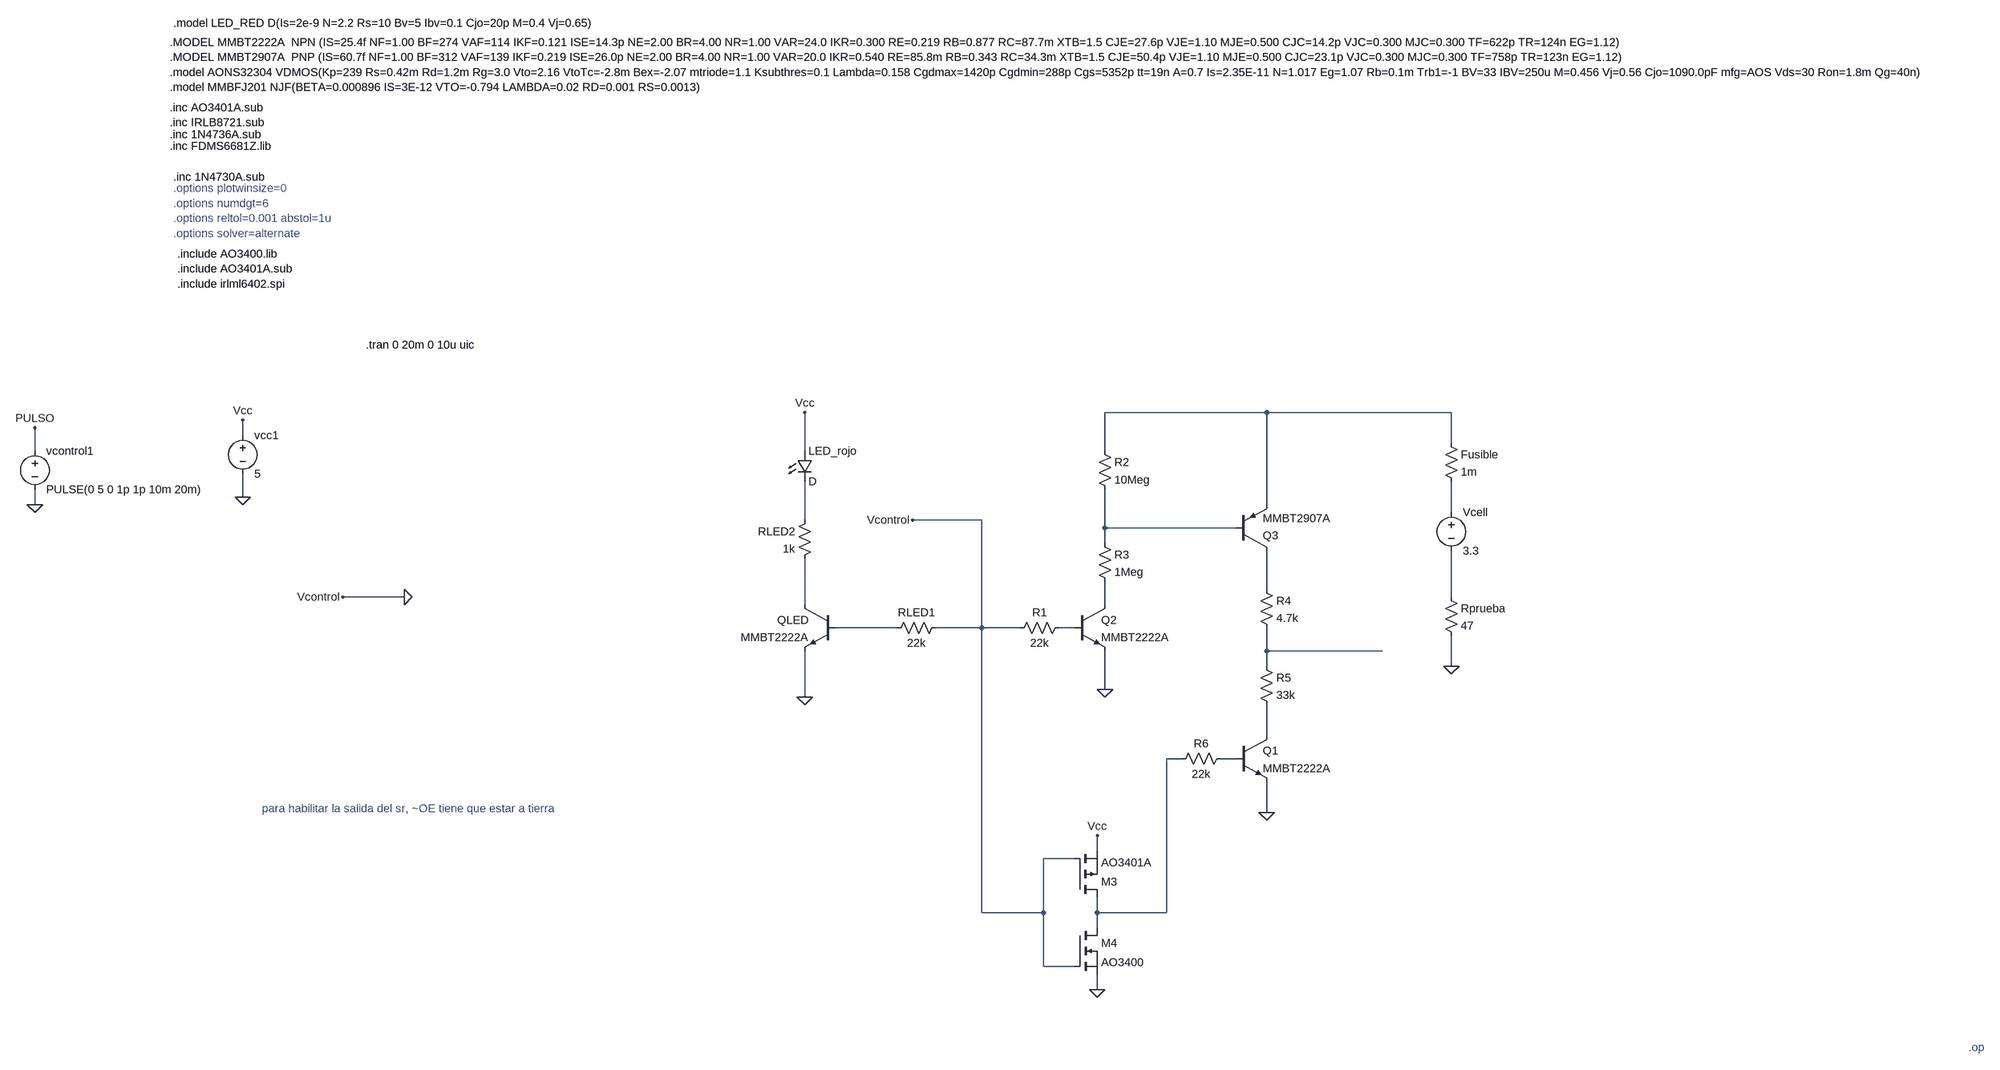
[diagram p0: schematic prueba_celda_2.1.asc]
prueba_celda_2.1.asc, the LTspice schematic file:
Version 4.1
SHEET 1 5252 680
WIRE 2688 -816 2352 -816
WIRE 3072 -816 2688 -816
WIRE 560 -768 560 -800
WIRE 3072 -752 3072 -816
WIRE 128 -736 128 -784
WIRE 1728 -736 1728 -816
WIRE 2352 -736 2352 -816
WIRE 560 -640 560 -688
WIRE 128 -624 128 -656
WIRE 2688 -624 2688 -816
WIRE 3072 -608 3072 -672
WIRE 1728 -592 1728 -672
WIRE 2096 -592 1952 -592
WIRE 2352 -576 2352 -656
WIRE 2624 -576 2352 -576
WIRE 2352 -544 2352 -576
WIRE 2688 -448 2688 -528
WIRE 896 -432 768 -432
WIRE 3072 -432 3072 -528
WIRE 1728 -416 1728 -512
WIRE 2352 -416 2352 -464
WIRE 1920 -368 1792 -368
WIRE 2096 -368 2096 -592
WIRE 2096 -368 2000 -368
WIRE 2176 -368 2096 -368
WIRE 2288 -368 2256 -368
WIRE 2688 -320 2688 -368
WIRE 2928 -320 2688 -320
WIRE 2688 -288 2688 -320
WIRE 3072 -288 3072 -352
WIRE 2352 -240 2352 -320
WIRE 1728 -224 1728 -320
WIRE 2688 -144 2688 -208
WIRE 2512 -96 2480 -96
WIRE 2624 -96 2592 -96
WIRE 2688 16 2688 -48
WIRE 2336 96 2336 64
WIRE 2288 112 2224 112
WIRE 2096 224 2096 -368
WIRE 2224 224 2224 112
WIRE 2224 224 2096 224
WIRE 2336 224 2336 192
WIRE 2480 224 2480 -96
WIRE 2480 224 2336 224
WIRE 2336 256 2336 224
WIRE 2224 336 2224 224
WIRE 2288 336 2224 336
WIRE 2336 384 2336 352
FLAG 128 -624 0
FLAG 560 -640 0
FLAG 560 -800 Vcc
FLAG 128 -784 PULSO
FLAG 2352 -240 0
FLAG 2688 16 0
FLAG 1728 -816 Vcc
FLAG 2336 384 0
FLAG 2336 64 Vcc
FLAG 1728 -224 0
FLAG 3072 -288 0
FLAG 1952 -592 Vcontrol
FLAG 768 -432 Vcontrol
FLAG 896 -432 0
SYMBOL voltage 128 -752 R0
WINDOW 123 0 0 Left 0
WINDOW 39 0 0 Left 0
SYMATTR InstName vcontrol1
SYMATTR Value PULSE(0 5 0 1p 1p 10m 20m)
SYMBOL voltage 560 -784 R0
WINDOW 123 0 0 Left 0
WINDOW 39 0 0 Left 0
SYMATTR InstName vcc1
SYMATTR Value 5
SYMBOL npn 2624 -144 R0
SYMATTR InstName Q1
SYMATTR Value MMBT2222A
SYMBOL res 2672 -304 R0
SYMATTR InstName R5
SYMATTR Value 33k
SYMBOL res 2672 -464 R0
SYMATTR InstName R4
SYMATTR Value 4.7k
SYMBOL npn 2288 -416 R0
SYMATTR InstName Q2
SYMATTR Value MMBT2222A
SYMBOL res 2336 -560 R0
SYMATTR InstName R3
SYMATTR Value 1Meg
SYMBOL res 2336 -752 R0
SYMATTR InstName R2
SYMATTR Value 10Meg
SYMBOL res 2608 -112 R90
WINDOW 0 0 56 VBottom 2
WINDOW 3 32 56 VTop 2
SYMATTR InstName R6
SYMATTR Value 22k
SYMBOL voltage 3072 -624 R0
WINDOW 123 0 0 Left 0
WINDOW 39 0 0 Left 0
SYMATTR InstName Vcell
SYMATTR Value 3.3
SYMBOL pnp 2624 -528 M180
SYMATTR InstName Q3
SYMATTR Value MMBT2907A
SYMBOL res 2272 -384 R90
WINDOW 0 0 56 VBottom 2
WINDOW 3 32 56 VTop 2
SYMATTR InstName R1
SYMATTR Value 22k
SYMBOL res 3056 -768 R0
SYMATTR InstName Fusible
SYMATTR Value 1m
SYMBOL npn 1792 -416 M0
SYMATTR InstName QLED
SYMATTR Value MMBT2222A
SYMBOL res 1744 -608 M0
SYMATTR InstName RLED2
SYMATTR Value 1k
SYMBOL LED 1712 -736 R0
SYMATTR InstName LED_rojo
SYMBOL res 2016 -384 R90
WINDOW 0 0 56 VBottom 2
WINDOW 3 32 56 VTop 2
SYMATTR InstName RLED1
SYMATTR Value 22k
SYMBOL pmos 2288 192 M180
SYMATTR InstName M3
SYMATTR Value AO3401A
SYMATTR Prefix X
SYMBOL nmos 2288 256 R0
SYMATTR InstName M4
SYMATTR Value AO3400
SYMATTR Prefix X
SYMBOL res 3056 -448 R0
SYMATTR InstName Rprueba
SYMATTR Value 47
TEXT 424 -1456 Left 2 !.include AO3400.lib\n.include AO3401A.sub\n.include irlml6402.spi
TEXT 600 8 Left 2 ;para habilitar la salida del sr, ~OE tiene que estar a tierra
TEXT 816 -968 Left 2 !.tran 0 20m 0 10u uic
TEXT 408 -1896 Left 2 !.MODEL MMBT2222A  NPN (IS=25.4f NF=1.00 BF=274 VAF=114 IKF=0.121 ISE=14.3p NE=2.00 BR=4.00 NR=1.00 VAR=24.0 IKR=0.300 RE=0.219 RB=0.877 RC=87.7m XTB=1.5 CJE=27.6p VJE=1.10 MJE=0.500 CJC=14.2p VJC=0.300 MJC=0.300 TF=622p TR=124n EG=1.12)\n.MODEL MMBT2907A  PNP (IS=60.7f NF=1.00 BF=312 VAF=139 IKF=0.219 ISE=26.0p NE=2.00 BR=4.00 NR=1.00 VAR=20.0 IKR=0.540 RE=85.8m RB=0.343 RC=34.3m XTB=1.5 CJE=50.4p VJE=1.10 MJE=0.500 CJC=23.1p VJC=0.300 MJC=0.300 TF=758p TR=123n EG=1.12)\n.model AONS32304 VDMOS(Kp=239 Rs=0.42m Rd=1.2m Rg=3.0 Vto=2.16 VtoTc=-2.8m Bex=-2.07 mtriode=1.1 Ksubthres=0.1 Lambda=0.158 Cgdmax=1420p Cgdmin=288p Cgs=5352p tt=19n A=0.7 Is=2.35E-11 N=1.017 Eg=1.07 Rb=0.1m Trb1=-1 BV=33 IBV=250u M=0.456 Vj=0.56 Cjo=1090.0pF mfg=AOS Vds=30 Ron=1.8m Qg=40n)\n.model MMBFJ201 NJF(BETA=0.000896 IS=3E-12 VTO=-0.794 LAMBDA=0.02 RD=0.001 RS=0.0013)
TEXT 408 -1760 Left 2 !.inc AO3401A.sub\n.inc IRLB8721.sub
TEXT 408 -1704 Left 2 !.inc 1N4736A.sub
TEXT 416 -1592 Left 2 ;.options plotwinsize=0\n.options numdgt=6\n.options reltol=0.001 abstol=1u\n.options solver=alternate
TEXT 408 -1680 Left 2 !.inc FDMS6681Z.lib
TEXT 416 -1616 Left 2 !.inc 1N4730A.sub
TEXT 416 -1936 Left 2 !.model LED_RED D(Is=2e-9 N=2.2 Rs=10 Bv=5 Ibv=0.1 Cjo=20p M=0.4 Vj=0.65)
TEXT 4992 504 Left 2 ;.op

The netlist it stands for:
* prueba_celda_2.1.asc
vcontrol1 PULSO 0 PULSE(0 5 0 1p 1p 10m 20m)
vcc1 Vcc 0 5
Q1 N012 N014 0 0 MMBT2222A
R5 N011 N012 33k
R4 N005 N011 4.7k
Q2 N008 N010 0 0 MMBT2222A
R3 N004 N008 1Meg
R2 N001 N004 10Meg
R6 N014 N013 22k
Vcell N002 N006 3.3
Q3 N005 N004 N001 0 MMBT2907A
R1 N010 0 22k
R§Fusible N001 N002 1m
QLED N007 N009 0 0 MMBT2222A
RLED2 N003 N007 1k
D§LED_rojo Vcc N003 D
RLED1 0 N009 22k
X§M3 N013 0 Vcc AO3401A  ; pins D G S
X§M4 N013 0 0 AO3400  ; pins D G S
Rprueba N006 0 47
.model D D
.lib standard.dio
.model NPN NPN
.model PNP PNP
.lib standard.bjt
.include AO3400.lib
.include AO3401A.sub
.include irlml6402.spi
* para habilitar la salida del sr, ~OE tiene que estar a tierra
.tran 0 20m 0 10u uic
.MODEL MMBT2222A  NPN (IS=25.4f NF=1.00 BF=274 VAF=114 IKF=0.121 ISE=14.3p NE=2.00 BR=4.00 NR=1.00 VAR=24.0 IKR=0.300 RE=0.219 RB=0.877 RC=87.7m XTB=1.5 CJE=27.6p VJE=1.10 MJE=0.500 CJC=14.2p VJC=0.300 MJC=0.300 TF=622p TR=124n EG=1.12)
.MODEL MMBT2907A  PNP (IS=60.7f NF=1.00 BF=312 VAF=139 IKF=0.219 ISE=26.0p NE=2.00 BR=4.00 NR=1.00 VAR=20.0 IKR=0.540 RE=85.8m RB=0.343 RC=34.3m XTB=1.5 CJE=50.4p VJE=1.10 MJE=0.500 CJC=23.1p VJC=0.300 MJC=0.300 TF=758p TR=123n EG=1.12)
.model AONS32304 VDMOS(Kp=239 Rs=0.42m Rd=1.2m Rg=3.0 Vto=2.16 VtoTc=-2.8m Bex=-2.07 mtriode=1.1 Ksubthres=0.1 Lambda=0.158 Cgdmax=1420p Cgdmin=288p Cgs=5352p tt=19n A=0.7 Is=2.35E-11 N=1.017 Eg=1.07 Rb=0.1m Trb1=-1 BV=33 IBV=250u M=0.456 Vj=0.56 Cjo=1090.0pF mfg=AOS Vds=30 Ron=1.8m Qg=40n)
.model MMBFJ201 NJF(BETA=0.000896 IS=3E-12 VTO=-0.794 LAMBDA=0.02 RD=0.001 RS=0.0013)
.inc AO3401A.sub
.inc IRLB8721.sub
.inc 1N4736A.sub
* .options plotwinsize=0
* .options numdgt=6
* .options reltol=0.001 abstol=1u
* .options solver=alternate
.inc FDMS6681Z.lib
.inc 1N4730A.sub
.model LED_RED D(Is=2e-9 N=2.2 Rs=10 Bv=5 Ibv=0.1 Cjo=20p M=0.4 Vj=0.65)
* .op
.backanno
.end